# Altium schematic sheet BMS_AMain.SchDoc
size A4
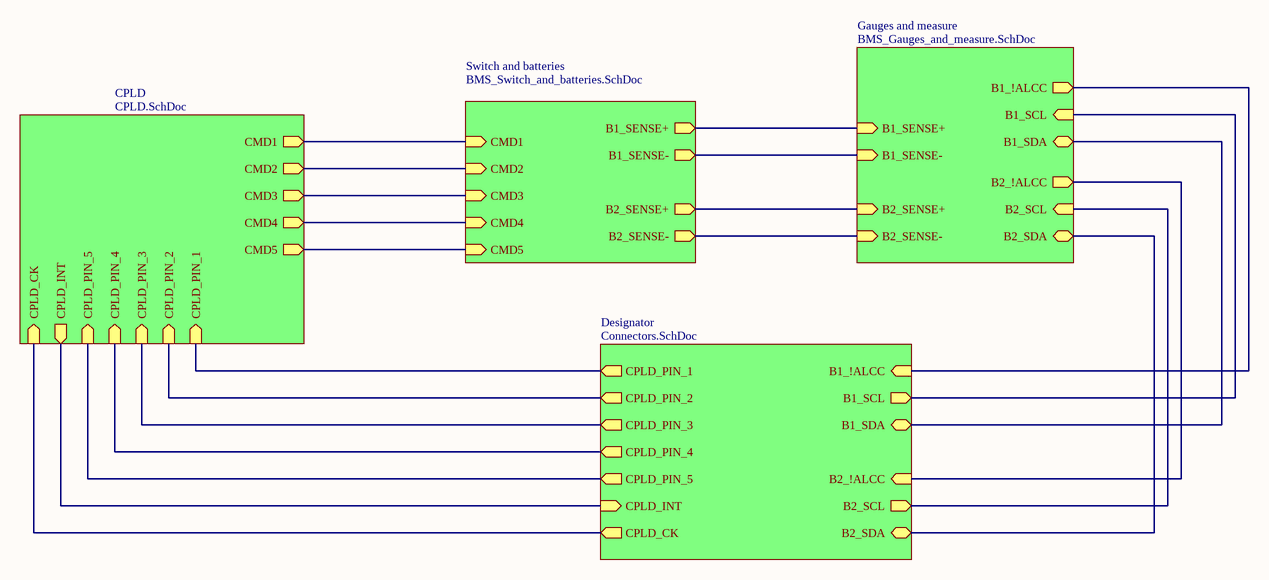
[diagram p0: BMS_AMain.SchDoc]

## Sub-sheets
CPLD = CPLD.SchDoc: CMD1 (out), CMD2 (out), CMD3 (out), CMD4 (out), CMD5 (out), CPLD_INT (out), CPLD_PIN_1 (in), CPLD_PIN_2 (in), CPLD_PIN_4 (in), CPLD_PIN_3 (in), CPLD_PIN_5 (in), CPLD_CK (in)
Designator = Connectors.SchDoc: B1_SDA (bidir), B1_!ALCC (in), B2_!ALCC (in), B2_SCL (out), B1_SCL (out), B2_SDA (bidir), CPLD_PIN_3 (out), CPLD_PIN_1 (out), CPLD_PIN_4 (out), CPLD_PIN_2 (out), CPLD_INT (in), CPLD_PIN_5 (out), CPLD_CK (out)
Gauges and measure = BMS_Gauges_and_measure.SchDoc: B1_SENSE+ (in), B1_SENSE- (in), B2_SENSE+ (in), B2_SENSE- (in), B1_!ALCC (out), B1_SDA (bidir), B1_SCL (in), B2_!ALCC (out), B2_SDA (bidir), B2_SCL (in)
Switch and batteries = BMS_Switch_and_batteries.SchDoc: CMD1 (in), CMD2 (in), CMD3 (in), CMD5 (in), CMD4 (in), B1_SENSE- (out), B1_SENSE+ (out), B2_SENSE+ (out), B2_SENSE- (out)

## Nets
(unnamed): sheet Switch and batteries/CMD1, sheet CPLD/CMD1
(unnamed): sheet Switch and batteries/CMD2, sheet CPLD/CMD2
(unnamed): sheet Switch and batteries/CMD3, sheet CPLD/CMD3
(unnamed): sheet Switch and batteries/CMD5, sheet CPLD/CMD5
(unnamed): sheet Switch and batteries/CMD4, sheet CPLD/CMD4
(unnamed): sheet Switch and batteries/B1_SENSE-, sheet Gauges and measure/B1_SENSE-
(unnamed): sheet Switch and batteries/B1_SENSE+, sheet Gauges and measure/B1_SENSE+
(unnamed): sheet Switch and batteries/B2_SENSE+, sheet Gauges and measure/B2_SENSE+
(unnamed): sheet Switch and batteries/B2_SENSE-, sheet Gauges and measure/B2_SENSE-
(unnamed): sheet Gauges and measure/B1_!ALCC, sheet Designator/B1_!ALCC
(unnamed): sheet Gauges and measure/B1_SDA, sheet Designator/B1_SDA
(unnamed): sheet Gauges and measure/B1_SCL, sheet Designator/B1_SCL
(unnamed): sheet Gauges and measure/B2_!ALCC, sheet Designator/B2_!ALCC
(unnamed): sheet Gauges and measure/B2_SDA, sheet Designator/B2_SDA
(unnamed): sheet Gauges and measure/B2_SCL, sheet Designator/B2_SCL
(unnamed): sheet CPLD/CPLD_INT, sheet Designator/CPLD_INT
(unnamed): sheet CPLD/CPLD_PIN_1, sheet Designator/CPLD_PIN_1
(unnamed): sheet CPLD/CPLD_PIN_2, sheet Designator/CPLD_PIN_2
(unnamed): sheet CPLD/CPLD_PIN_4, sheet Designator/CPLD_PIN_4
(unnamed): sheet CPLD/CPLD_PIN_3, sheet Designator/CPLD_PIN_3
(unnamed): sheet CPLD/CPLD_PIN_5, sheet Designator/CPLD_PIN_5
(unnamed): sheet CPLD/CPLD_CK, sheet Designator/CPLD_CK

## Notes on the sheet
- Title
- Size:
- Date:
- Battery Management System
- A4
- Number:
- Time:
- 1
- Revision:
- Author: GEI Corp
- V1.0
- GEI Corp
- 135 avenue de Rangueil
- INSA Toulouse
- 31400 Toulouse
- FRANCE
- File:
- Projet_Inter_1\BMS_GEI_CORP